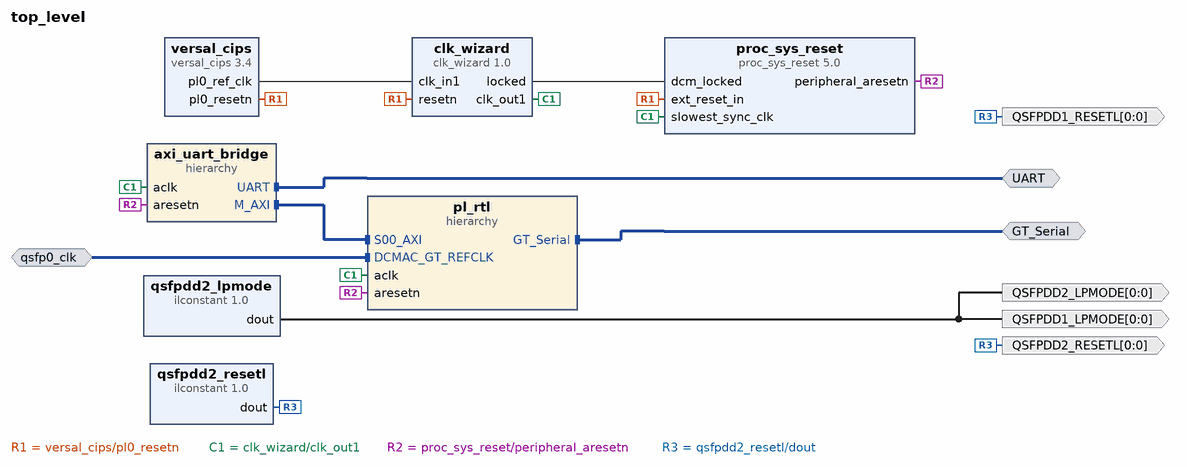
[diagram p0: block diagram of the top level]
# Vivado block design top_level, xcvp1202-vsva2785-2MP-e-S, Vivado 2024.2
create_bd_design top_level

create_bd_intf_port -mode Master -vlnv xilinx.com:interface:uart_rtl:1.0 UART
create_bd_intf_port -mode Master -vlnv xilinx.com:interface:gt_rtl:1.0 GT_Serial
create_bd_intf_port -mode Slave -vlnv xilinx.com:interface:diff_clock_rtl:1.0 qsfp0_clk
set_property -dict {CONFIG.FREQ_HZ 156250000} [get_bd_intf_ports qsfp0_clk]
create_bd_port -dir O -from 0 -to 0 QSFPDD2_LPMODE
create_bd_port -dir O -from 0 -to 0 QSFPDD2_RESETL
create_bd_port -dir O -from 0 -to 0 QSFPDD1_RESETL
create_bd_port -dir O -from 0 -to 0 QSFPDD1_LPMODE

create_bd_cell -type hier pl_rtl
create_bd_cell -type ip -vlnv xilinx.com:ip:clk_wizard:1.0 clk_wizard
set_property -dict [list \
  CONFIG.CLKOUT_DRIVES BUFG,BUFG,BUFG,BUFG,BUFG,BUFG,BUFG \
  CONFIG.CLKOUT_DYN_PS None,None,None,None,None,None,None \
  CONFIG.CLKOUT_MATCHED_ROUTING false,false,false,false,false,false,false \
  CONFIG.CLKOUT_PORT clk_out1,clk_out2,clk_out3,clk_out4,clk_out5,clk_out6,clk_out7 \
  CONFIG.CLKOUT_REQUESTED_DUTY_CYCLE 50.000,50.000,50.000,50.000,50.000,50.000,50.000 \
  CONFIG.CLKOUT_REQUESTED_OUT_FREQUENCY 200,150.000,300.000,100.000,100.000,100.000,100.000 \
  CONFIG.CLKOUT_REQUESTED_PHASE 0.000,0.000,0.000,0.000,0.000,0.000,0.000 \
  CONFIG.CLKOUT_USED true,false,false,false,false,false,false \
  CONFIG.JITTER_SEL Min_O_Jitter \
  CONFIG.PRIM_SOURCE No_buffer \
  CONFIG.RESET_TYPE ACTIVE_LOW \
  CONFIG.USE_LOCKED true \
  CONFIG.USE_PHASE_ALIGNMENT true \
  CONFIG.USE_RESET true \
] [get_bd_cells clk_wizard]
create_bd_cell -type ip -vlnv xilinx.com:ip:proc_sys_reset:5.0 proc_sys_reset
create_bd_cell -type inline_hdl -vlnv xilinx.com:inline_hdl:ilconstant:1.0 qsfpdd2_lpmode
set_property -dict {CONFIG.CONST_VAL 0} [get_bd_cells qsfpdd2_lpmode]
create_bd_cell -type inline_hdl -vlnv xilinx.com:inline_hdl:ilconstant:1.0 qsfpdd2_resetl
create_bd_cell -type ip -vlnv xilinx.com:ip:versal_cips:3.4 versal_cips
set_property -dict [list \
  CONFIG.DDR_MEMORY_MODE Custom \
  CONFIG.DEBUG_MODE JTAG \
  CONFIG.DESIGN_MODE 0 \
  CONFIG.PS_BOARD_INTERFACE Custom \
  CONFIG.PS_PMC_CONFIG {['DEBUG_MODE JTAG DESIGN_MODE 0 PS_BOARD_INTERFACE Custom PS_HSDP_EGRESS_TRAFFIC JTAG PS_HSDP_INGRESS_TRAFFIC JTAG PS_HSDP_MODE NONE PS_NUM_FABRIC_RESETS 1 PS_USE_PMCPL_CLK0 1 SMON_ALARMS Set_Alarms_On', 'SMON_ENABLE_TEMP_AVERAGING 0 SMON_TEMP_AVERAGING_SAMPLES 0']} \
] [get_bd_cells versal_cips]
create_bd_cell -type hier axi_uart_bridge

# ---- hierarchy /pl_rtl ----
current_bd_instance /pl_rtl
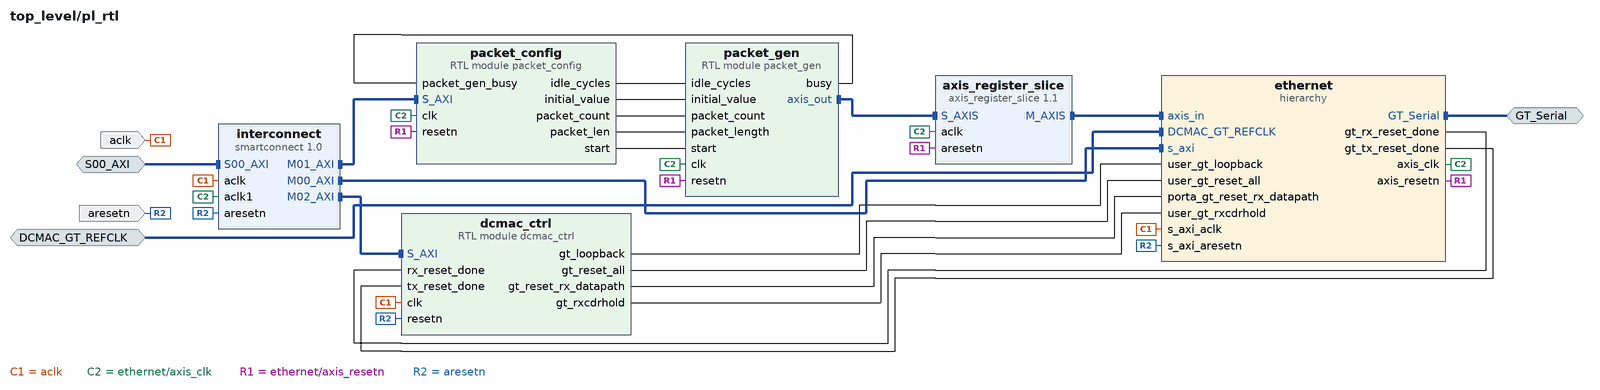
[diagram p1: block diagram inside /pl_rtl]
create_bd_intf_pin -mode Slave -vlnv xilinx.com:interface:diff_clock_rtl:1.0 DCMAC_GT_REFCLK
create_bd_intf_pin -mode Master -vlnv xilinx.com:interface:gt_rtl:1.0 GT_Serial
create_bd_intf_pin -mode Slave -vlnv xilinx.com:interface:aximm_rtl:1.0 S00_AXI
create_bd_pin -dir I -type clk aclk
create_bd_pin -dir I -type rst aresetn

create_bd_cell -type ip -vlnv xilinx.com:ip:smartconnect:1.0 interconnect
set_property -dict {CONFIG.NUM_CLKS 2 CONFIG.NUM_MI 3 CONFIG.NUM_SI 1} [get_bd_cells interconnect]
create_bd_cell -type hier ethernet
create_bd_cell -type module -reference packet_config packet_config
create_bd_cell -type module -reference packet_gen packet_gen
create_bd_cell -type module -reference dcmac_ctrl dcmac_ctrl
create_bd_cell -type ip -vlnv xilinx.com:ip:axis_register_slice:1.1 axis_register_slice

# ---- hierarchy /pl_rtl/ethernet ----
current_bd_instance /pl_rtl/ethernet
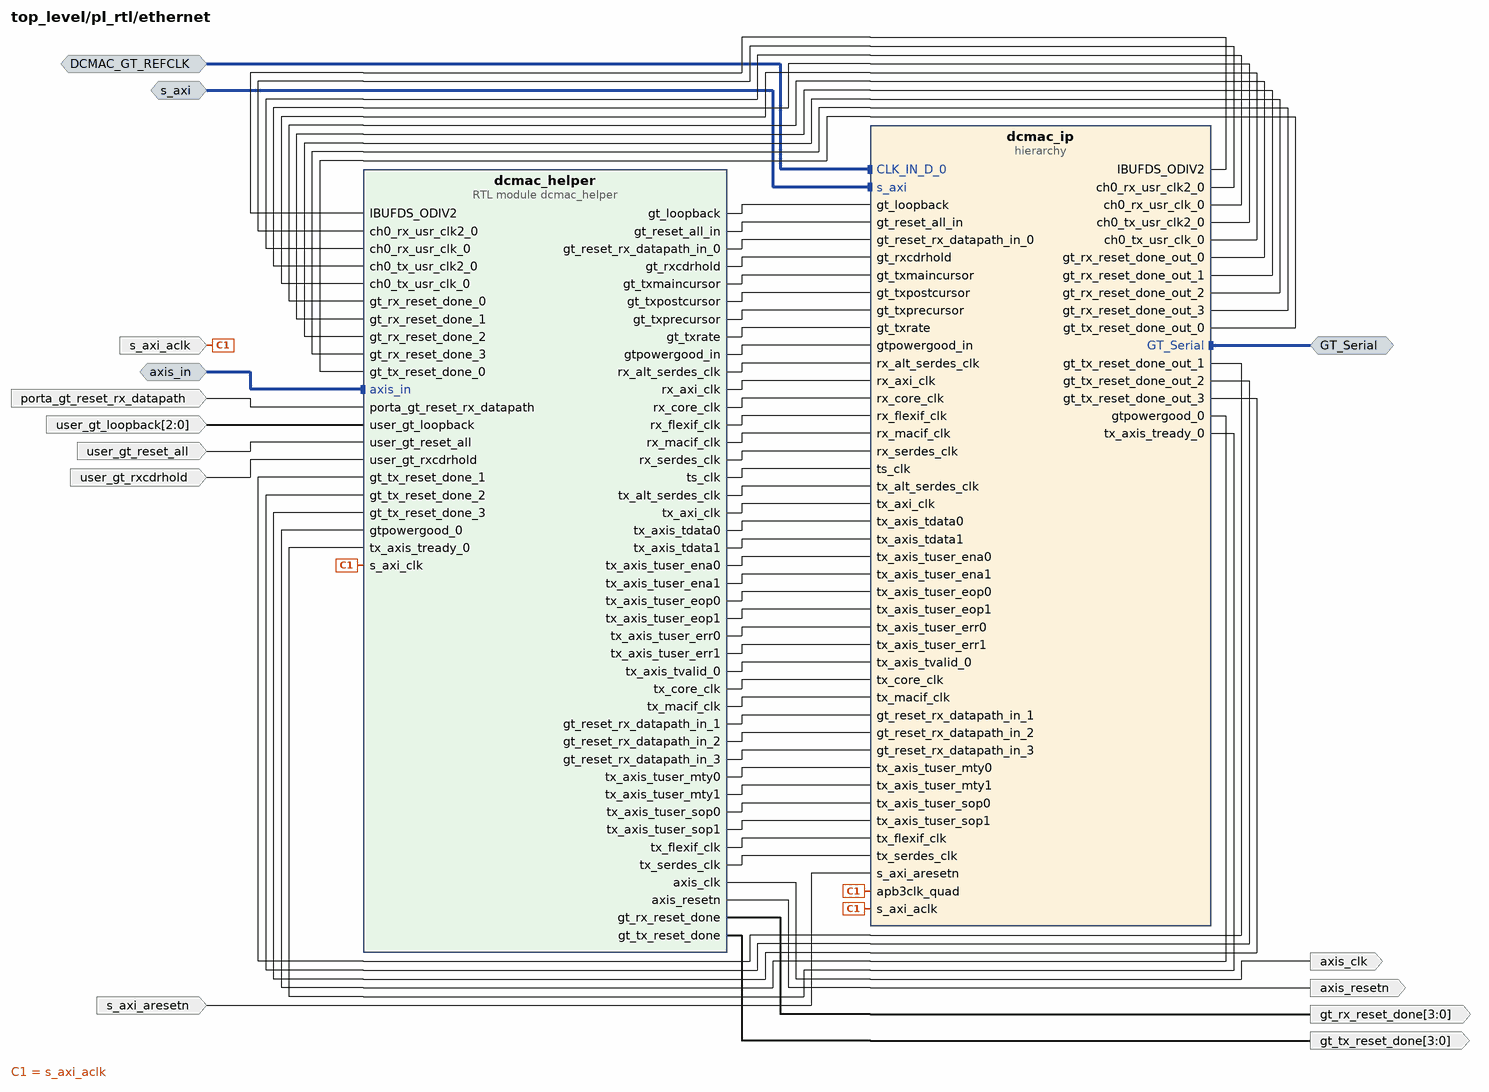
[diagram p2: block diagram inside /pl_rtl/ethernet]
create_bd_intf_pin -mode Slave -vlnv xilinx.com:interface:aximm_rtl:1.0 s_axi
create_bd_intf_pin -mode Master -vlnv xilinx.com:interface:gt_rtl:1.0 GT_Serial
create_bd_intf_pin -mode Slave -vlnv xilinx.com:interface:diff_clock_rtl:1.0 DCMAC_GT_REFCLK
create_bd_intf_pin -mode Slave -vlnv xilinx.com:interface:axis_rtl:1.0 axis_in
create_bd_pin -dir I -type clk s_axi_aclk
create_bd_pin -dir I -type rst s_axi_aresetn
create_bd_pin -dir O axis_clk
create_bd_pin -dir I user_gt_reset_all
create_bd_pin -dir O axis_resetn
create_bd_pin -dir O -from 3 -to 0 gt_rx_reset_done
create_bd_pin -dir O -from 3 -to 0 gt_tx_reset_done
create_bd_pin -dir I porta_gt_reset_rx_datapath
create_bd_pin -dir I -from 2 -to 0 user_gt_loopback
create_bd_pin -dir I user_gt_rxcdrhold

create_bd_cell -type hier dcmac_ip
create_bd_cell -type module -reference dcmac_helper dcmac_helper

# ---- hierarchy /pl_rtl/ethernet/dcmac_ip ----
current_bd_instance /pl_rtl/ethernet/dcmac_ip
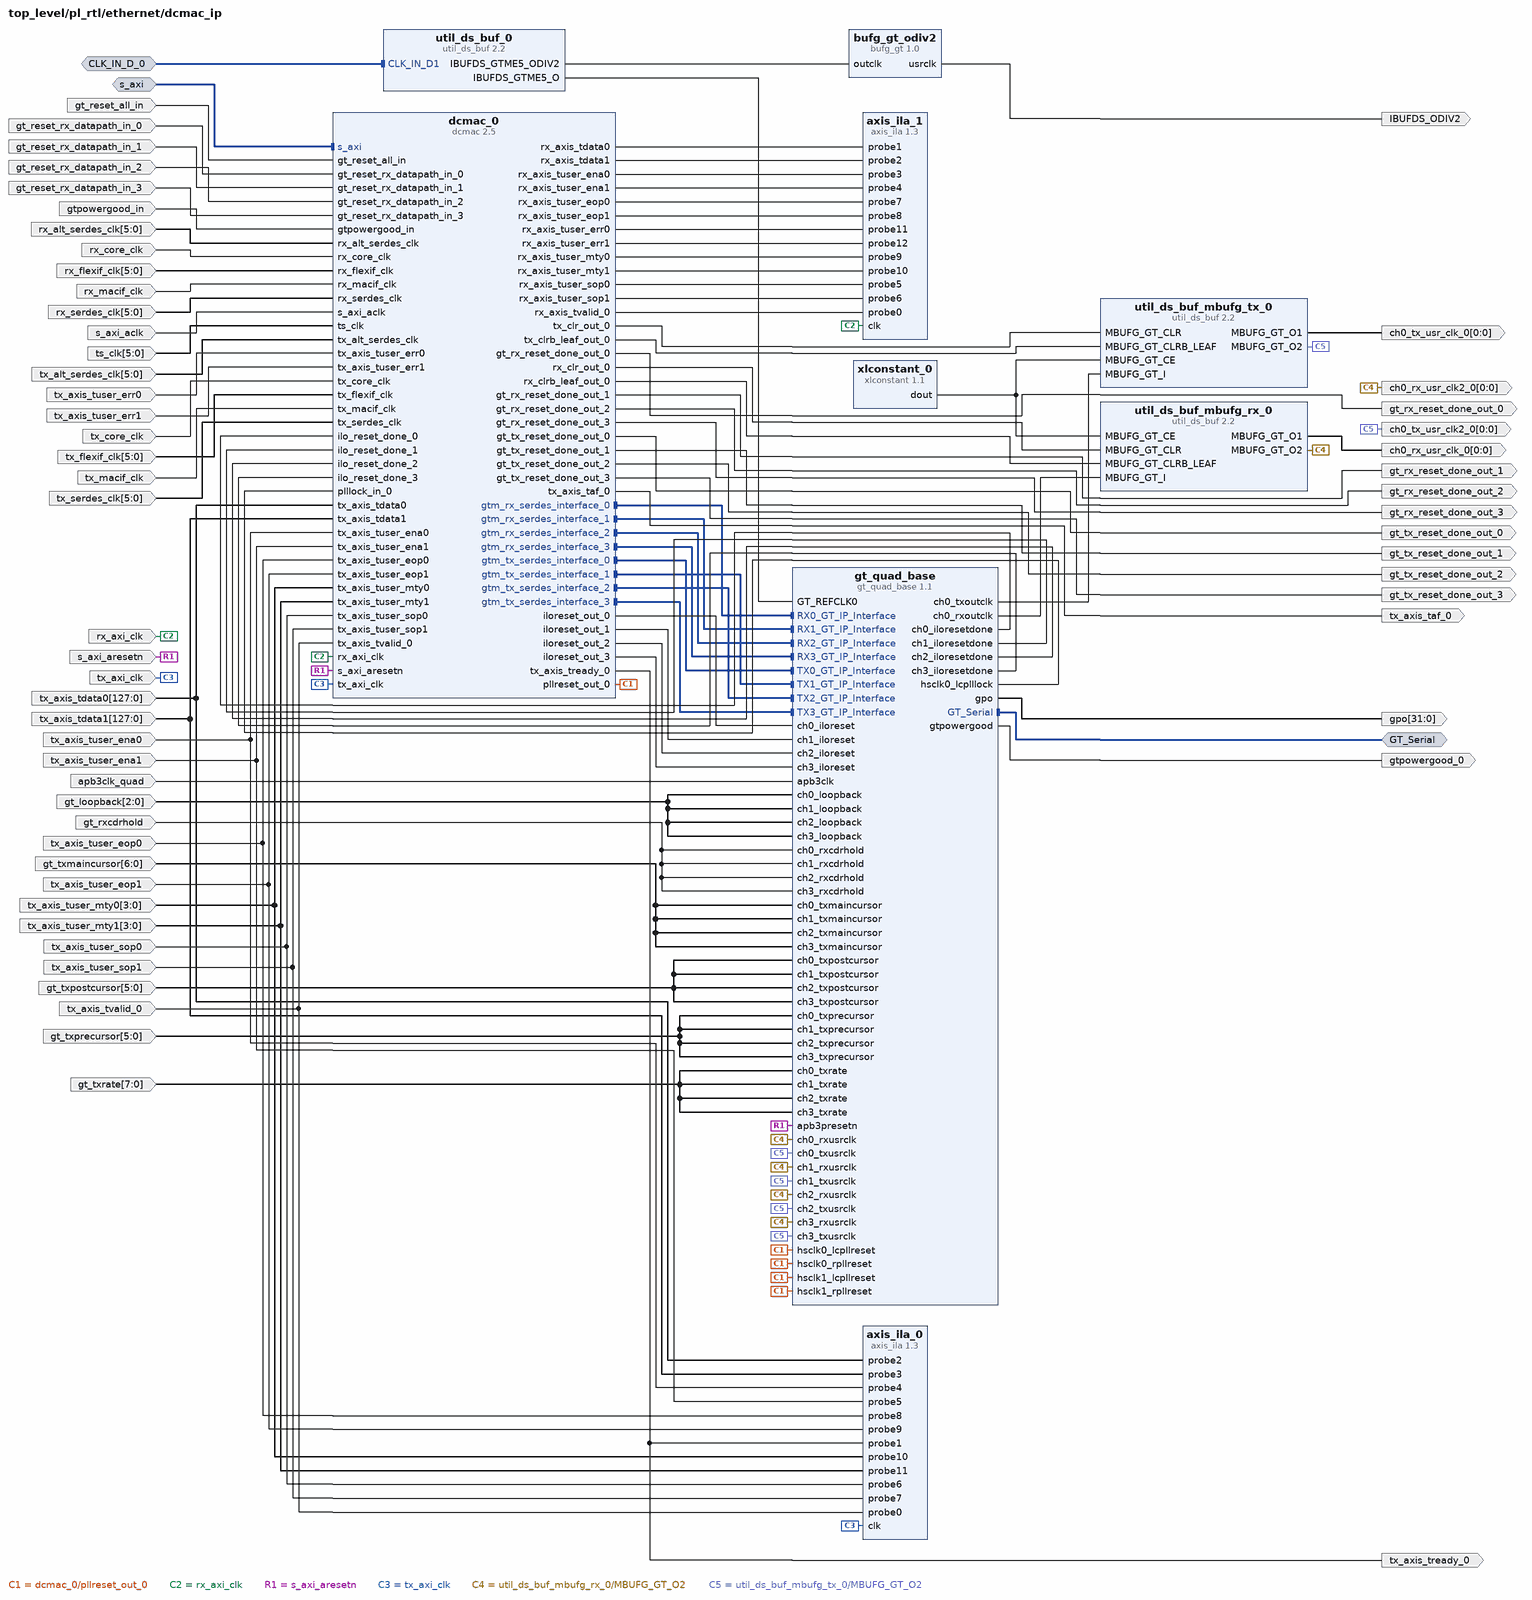
[diagram p3: block diagram inside /pl_rtl/ethernet/dcmac_ip]
create_bd_intf_pin -mode Slave -vlnv xilinx.com:interface:aximm_rtl:1.0 s_axi
create_bd_intf_pin -mode Master -vlnv xilinx.com:interface:gt_rtl:1.0 GT_Serial
create_bd_intf_pin -mode Slave -vlnv xilinx.com:interface:diff_clock_rtl:1.0 CLK_IN_D_0
create_bd_pin -dir I -type clk s_axi_aclk
create_bd_pin -dir I -type rst s_axi_aresetn
create_bd_pin -dir O tx_axis_taf_0
create_bd_pin -dir O tx_axis_tready_0
create_bd_pin -dir I -from 5 -to 0 -type gt_usrclk rx_alt_serdes_clk
create_bd_pin -dir I -type clk rx_axi_clk
create_bd_pin -dir I -type clk rx_core_clk
create_bd_pin -dir I -from 5 -to 0 -type clk rx_flexif_clk
create_bd_pin -dir I -type clk rx_macif_clk
create_bd_pin -dir I -from 5 -to 0 -type gt_usrclk rx_serdes_clk
create_bd_pin -dir I -from 5 -to 0 -type clk ts_clk
create_bd_pin -dir I -from 5 -to 0 -type gt_usrclk tx_alt_serdes_clk
create_bd_pin -dir I -from 127 -to 0 tx_axis_tdata0
create_bd_pin -dir I -from 127 -to 0 tx_axis_tdata1
create_bd_pin -dir I tx_axis_tuser_ena0
create_bd_pin -dir I tx_axis_tuser_ena1
create_bd_pin -dir I tx_axis_tuser_eop0
create_bd_pin -dir I tx_axis_tuser_eop1
create_bd_pin -dir I tx_axis_tuser_err0
create_bd_pin -dir I tx_axis_tuser_err1
create_bd_pin -dir I -from 3 -to 0 tx_axis_tuser_mty0
create_bd_pin -dir I -from 3 -to 0 tx_axis_tuser_mty1
create_bd_pin -dir I tx_axis_tuser_sop0
create_bd_pin -dir I tx_axis_tuser_sop1
create_bd_pin -dir I tx_axis_tvalid_0
create_bd_pin -dir I -type clk tx_axi_clk
create_bd_pin -dir I -type clk tx_core_clk
create_bd_pin -dir I -from 5 -to 0 -type clk tx_flexif_clk
create_bd_pin -dir I -type clk tx_macif_clk
create_bd_pin -dir I -from 5 -to 0 -type gt_usrclk tx_serdes_clk
create_bd_pin -dir O gt_tx_reset_done_out_0
create_bd_pin -dir O gt_rx_reset_done_out_0
create_bd_pin -dir I gtpowergood_in
create_bd_pin -dir I gt_reset_all_in
create_bd_pin -dir I gt_reset_rx_datapath_in_0
create_bd_pin -dir O gt_tx_reset_done_out_1
create_bd_pin -dir O gt_rx_reset_done_out_1
create_bd_pin -dir I gt_reset_rx_datapath_in_1
create_bd_pin -dir O gt_tx_reset_done_out_2
create_bd_pin -dir O gt_rx_reset_done_out_2
create_bd_pin -dir I gt_reset_rx_datapath_in_2
create_bd_pin -dir O gt_tx_reset_done_out_3
create_bd_pin -dir O gt_rx_reset_done_out_3
create_bd_pin -dir I gt_reset_rx_datapath_in_3
create_bd_pin -dir O -type gt_usrclk IBUFDS_ODIV2
create_bd_pin -dir O -from 0 -to 0 -type gt_usrclk ch0_tx_usr_clk_0
create_bd_pin -dir O -from 0 -to 0 -type gt_usrclk ch0_tx_usr_clk2_0
create_bd_pin -dir O -from 0 -to 0 -type gt_usrclk ch0_rx_usr_clk_0
create_bd_pin -dir O -from 0 -to 0 -type gt_usrclk ch0_rx_usr_clk2_0
create_bd_pin -dir O gtpowergood_0
create_bd_pin -dir O -from 31 -to 0 gpo
create_bd_pin -dir I -type clk apb3clk_quad
create_bd_pin -dir I -from 6 -to 0 gt_txmaincursor
create_bd_pin -dir I -from 5 -to 0 gt_txpostcursor
create_bd_pin -dir I -from 5 -to 0 gt_txprecursor
create_bd_pin -dir I -from 7 -to 0 gt_txrate
create_bd_pin -dir I -from 2 -to 0 gt_loopback
create_bd_pin -dir I gt_rxcdrhold

create_bd_cell -type ip -vlnv xilinx.com:ip:dcmac:2.5 dcmac_0
set_property -dict [list \
  CONFIG.MAC_PORT0_CONFIG_C0 100CAUI-4 \
  CONFIG.MAC_PORT0_RX_STRIP_C0 1 \
  CONFIG.MAC_PORT1_ENABLE_C0 0 \
  CONFIG.MAC_PORT2_ENABLE_C0 0 \
  CONFIG.MAC_PORT3_ENABLE_C0 0 \
  CONFIG.MAC_PORT4_ENABLE_C0 0 \
  CONFIG.MAC_PORT5_ENABLE_C0 0 \
] [get_bd_cells dcmac_0]
create_bd_cell -type ip -vlnv xilinx.com:ip:xlconstant:1.1 xlconstant_0
set_property -dict {CONFIG.CONST_VAL 1 CONFIG.CONST_WIDTH 1} [get_bd_cells xlconstant_0]
create_bd_cell -type ip -vlnv xilinx.com:ip:bufg_gt:1.0 bufg_gt_odiv2
create_bd_cell -type ip -vlnv xilinx.com:ip:util_ds_buf:2.2 util_ds_buf_mbufg_tx_0
set_property -dict {CONFIG.C_BUFG_GT_SYNC true CONFIG.C_BUF_TYPE MBUFG_GT} [get_bd_cells util_ds_buf_mbufg_tx_0]
create_bd_cell -type ip -vlnv xilinx.com:ip:util_ds_buf:2.2 util_ds_buf_mbufg_rx_0
set_property -dict {CONFIG.C_BUFG_GT_SYNC true CONFIG.C_BUF_TYPE MBUFG_GT} [get_bd_cells util_ds_buf_mbufg_rx_0]
create_bd_cell -type ip -vlnv xilinx.com:ip:gt_quad_base:1.1 gt_quad_base
set_property -dict [list \
  CONFIG.APB3_CLK_FREQUENCY 199.999995 \
  CONFIG.PORTS_INFO_DICT {LANE_SEL_DICT {PROT0 {RX0 RX1 RX2 RX3 TX0 TX1 TX2 TX3}} GT_TYPE GTM REG_CONF_INTF APB3_INTF BOARD_PARAMETER { }} \
  CONFIG.REFCLK_LIST {{/qsfp0_clk_clk_p[0]}} \
  CONFIG.REFCLK_STRING {HSCLK0_LCPLLGTREFCLK0 refclk_PROT0_R0_156.25_MHz_unique1} \
] [get_bd_cells gt_quad_base]
create_bd_cell -type ip -vlnv xilinx.com:ip:util_ds_buf:2.2 util_ds_buf_0
set_property -dict {CONFIG.C_BUF_TYPE IBUFDS_GTME5} [get_bd_cells util_ds_buf_0]
create_bd_cell -type ip -vlnv xilinx.com:ip:axis_ila:1.3 axis_ila_0
set_property -dict [list \
  CONFIG.C_NUM_OF_PROBES 12 \
  CONFIG.C_PROBE10_WIDTH 4 \
  CONFIG.C_PROBE11_WIDTH 4 \
  CONFIG.C_PROBE2_WIDTH 128 \
  CONFIG.C_PROBE3_WIDTH 128 \
] [get_bd_cells axis_ila_0]
create_bd_cell -type ip -vlnv xilinx.com:ip:axis_ila:1.3 axis_ila_1
set_property -dict [list \
  CONFIG.C_NUM_OF_PROBES 13 \
  CONFIG.C_PROBE10_WIDTH 4 \
  CONFIG.C_PROBE1_WIDTH 128 \
  CONFIG.C_PROBE2_WIDTH 128 \
  CONFIG.C_PROBE9_WIDTH 4 \
  CONFIG.C_PROBE_WIDTH_PROPAGATION MANUAL \
] [get_bd_cells axis_ila_1]

# ---- hierarchy /axi_uart_bridge ----
current_bd_instance /axi_uart_bridge
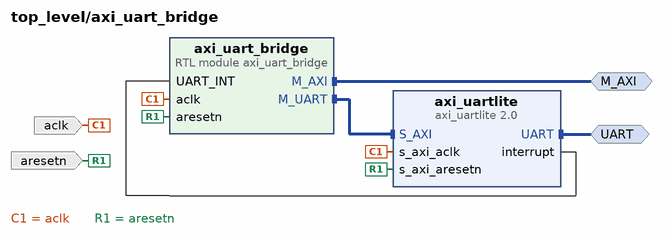
[diagram p4: block diagram inside /axi_uart_bridge]
create_bd_intf_pin -mode Master -vlnv xilinx.com:interface:uart_rtl:1.0 UART
create_bd_intf_pin -mode Master -vlnv xilinx.com:interface:aximm_rtl:1.0 M_AXI
create_bd_pin -dir I aclk
create_bd_pin -dir I aresetn

create_bd_cell -type module -reference axi_uart_bridge axi_uart_bridge
create_bd_cell -type ip -vlnv xilinx.com:ip:axi_uartlite:2.0 axi_uartlite
set_property -dict {CONFIG.C_BAUDRATE 115200} [get_bd_cells axi_uartlite]

# ---- connections ----

current_bd_instance /pl_rtl
connect_bd_intf_net [get_bd_intf_pins ethernet/DCMAC_GT_REFCLK] [get_bd_intf_pins DCMAC_GT_REFCLK]
connect_bd_intf_net [get_bd_intf_pins ethernet/GT_Serial] [get_bd_intf_pins GT_Serial]
connect_bd_intf_net [get_bd_intf_pins interconnect/S00_AXI] [get_bd_intf_pins S00_AXI]
connect_bd_intf_net -intf_net axis_register_slice_0_M_AXIS [get_bd_intf_pins axis_register_slice/M_AXIS] [get_bd_intf_pins ethernet/axis_in]
connect_bd_intf_net -intf_net icn_ctrl_M01_AXI [get_bd_intf_pins packet_config/S_AXI] [get_bd_intf_pins interconnect/M01_AXI]
connect_bd_intf_net -intf_net icn_ctrl_M02_AXI [get_bd_intf_pins interconnect/M02_AXI] [get_bd_intf_pins dcmac_ctrl/S_AXI]
connect_bd_intf_net [get_bd_intf_pins axis_register_slice/S_AXIS] [get_bd_intf_pins packet_gen/axis_out]
connect_bd_intf_net [get_bd_intf_pins ethernet/s_axi] [get_bd_intf_pins interconnect/M00_AXI]
connect_bd_net -net clk_wizard_0_clk_out1 [get_bd_pins aclk] \
  [get_bd_pins interconnect/aclk] [get_bd_pins ethernet/s_axi_aclk] [get_bd_pins dcmac_ctrl/clk]
connect_bd_net -net dcmac_ctrl_0_gt_loopback [get_bd_pins dcmac_ctrl/gt_loopback] [get_bd_pins ethernet/user_gt_loopback]
connect_bd_net -net dcmac_ctrl_0_gt_reset_all [get_bd_pins dcmac_ctrl/gt_reset_all] [get_bd_pins ethernet/user_gt_reset_all]
connect_bd_net -net dcmac_ctrl_0_gt_reset_rx_datapath [get_bd_pins dcmac_ctrl/gt_reset_rx_datapath] [get_bd_pins ethernet/porta_gt_reset_rx_datapath]
connect_bd_net -net dcmac_ctrl_0_gt_rxcdrhold [get_bd_pins dcmac_ctrl/gt_rxcdrhold] [get_bd_pins ethernet/user_gt_rxcdrhold]
connect_bd_net [get_bd_pins ethernet/axis_clk] \
  [get_bd_pins packet_config/clk] [get_bd_pins packet_gen/clk] [get_bd_pins interconnect/aclk1] \
  [get_bd_pins axis_register_slice/aclk]
connect_bd_net [get_bd_pins ethernet/axis_resetn] \
  [get_bd_pins packet_config/resetn] [get_bd_pins packet_gen/resetn] [get_bd_pins axis_register_slice/aresetn]
connect_bd_net [get_bd_pins ethernet/gt_rx_reset_done] [get_bd_pins dcmac_ctrl/rx_reset_done]
connect_bd_net [get_bd_pins ethernet/gt_tx_reset_done] [get_bd_pins dcmac_ctrl/tx_reset_done]
connect_bd_net [get_bd_pins packet_config/idle_cycles] [get_bd_pins packet_gen/idle_cycles]
connect_bd_net [get_bd_pins packet_config/initial_value] [get_bd_pins packet_gen/initial_value]
connect_bd_net [get_bd_pins packet_config/packet_count] [get_bd_pins packet_gen/packet_count]
connect_bd_net [get_bd_pins packet_config/packet_len] [get_bd_pins packet_gen/packet_length]
connect_bd_net [get_bd_pins packet_config/start] [get_bd_pins packet_gen/start]
connect_bd_net [get_bd_pins packet_gen/busy] [get_bd_pins packet_config/packet_gen_busy]
connect_bd_net -net proc_sys_reset_0_peripheral_aresetn [get_bd_pins aresetn] \
  [get_bd_pins interconnect/aresetn] [get_bd_pins ethernet/s_axi_aresetn] [get_bd_pins dcmac_ctrl/resetn]

current_bd_instance /pl_rtl/ethernet
connect_bd_intf_net -intf_net CLK_IN_D_0_1 [get_bd_intf_pins DCMAC_GT_REFCLK] [get_bd_intf_pins dcmac_ip/CLK_IN_D_0]
connect_bd_intf_net [get_bd_intf_pins axis_in] [get_bd_intf_pins dcmac_helper/axis_in]
connect_bd_intf_net -intf_net gt_quad_base_GT_Serial [get_bd_intf_pins GT_Serial] [get_bd_intf_pins dcmac_ip/GT_Serial]
connect_bd_intf_net [get_bd_intf_pins s_axi] [get_bd_intf_pins dcmac_ip/s_axi]
connect_bd_net [get_bd_pins dcmac_helper/axis_clk] [get_bd_pins axis_clk]
connect_bd_net [get_bd_pins dcmac_helper/axis_resetn] [get_bd_pins axis_resetn]
connect_bd_net [get_bd_pins dcmac_helper/gt_loopback] [get_bd_pins dcmac_ip/gt_loopback]
connect_bd_net [get_bd_pins dcmac_helper/gt_reset_all_in] [get_bd_pins dcmac_ip/gt_reset_all_in]
connect_bd_net [get_bd_pins dcmac_helper/gt_reset_rx_datapath_in_0] [get_bd_pins dcmac_ip/gt_reset_rx_datapath_in_0]
connect_bd_net [get_bd_pins dcmac_helper/gt_rx_reset_done] [get_bd_pins gt_rx_reset_done]
connect_bd_net [get_bd_pins dcmac_helper/gt_rxcdrhold] [get_bd_pins dcmac_ip/gt_rxcdrhold]
connect_bd_net [get_bd_pins dcmac_helper/gt_tx_reset_done] [get_bd_pins gt_tx_reset_done]
connect_bd_net [get_bd_pins dcmac_helper/gt_txmaincursor] [get_bd_pins dcmac_ip/gt_txmaincursor]
connect_bd_net [get_bd_pins dcmac_helper/gt_txpostcursor] [get_bd_pins dcmac_ip/gt_txpostcursor]
connect_bd_net [get_bd_pins dcmac_helper/gt_txprecursor] [get_bd_pins dcmac_ip/gt_txprecursor]
connect_bd_net [get_bd_pins dcmac_helper/gt_txrate] [get_bd_pins dcmac_ip/gt_txrate]
connect_bd_net [get_bd_pins dcmac_helper/gtpowergood_in] [get_bd_pins dcmac_ip/gtpowergood_in]
connect_bd_net [get_bd_pins dcmac_helper/rx_alt_serdes_clk] [get_bd_pins dcmac_ip/rx_alt_serdes_clk]
connect_bd_net [get_bd_pins dcmac_helper/rx_axi_clk] [get_bd_pins dcmac_ip/rx_axi_clk]
connect_bd_net [get_bd_pins dcmac_helper/rx_core_clk] [get_bd_pins dcmac_ip/rx_core_clk]
connect_bd_net [get_bd_pins dcmac_helper/rx_flexif_clk] [get_bd_pins dcmac_ip/rx_flexif_clk]
connect_bd_net [get_bd_pins dcmac_helper/rx_macif_clk] [get_bd_pins dcmac_ip/rx_macif_clk]
connect_bd_net [get_bd_pins dcmac_helper/rx_serdes_clk] [get_bd_pins dcmac_ip/rx_serdes_clk]
connect_bd_net [get_bd_pins dcmac_helper/ts_clk] [get_bd_pins dcmac_ip/ts_clk]
connect_bd_net [get_bd_pins dcmac_helper/tx_alt_serdes_clk] [get_bd_pins dcmac_ip/tx_alt_serdes_clk]
connect_bd_net [get_bd_pins dcmac_helper/tx_axi_clk] [get_bd_pins dcmac_ip/tx_axi_clk]
connect_bd_net [get_bd_pins dcmac_helper/tx_axis_tdata0] [get_bd_pins dcmac_ip/tx_axis_tdata0]
connect_bd_net [get_bd_pins dcmac_helper/tx_axis_tdata1] [get_bd_pins dcmac_ip/tx_axis_tdata1]
connect_bd_net [get_bd_pins dcmac_helper/tx_axis_tuser_ena0] [get_bd_pins dcmac_ip/tx_axis_tuser_ena0]
connect_bd_net [get_bd_pins dcmac_helper/tx_axis_tuser_ena1] [get_bd_pins dcmac_ip/tx_axis_tuser_ena1]
connect_bd_net [get_bd_pins dcmac_helper/tx_axis_tuser_eop0] [get_bd_pins dcmac_ip/tx_axis_tuser_eop0]
connect_bd_net [get_bd_pins dcmac_helper/tx_axis_tuser_eop1] [get_bd_pins dcmac_ip/tx_axis_tuser_eop1]
connect_bd_net [get_bd_pins dcmac_helper/tx_axis_tuser_err0] [get_bd_pins dcmac_ip/tx_axis_tuser_err0]
connect_bd_net [get_bd_pins dcmac_helper/tx_axis_tuser_err1] [get_bd_pins dcmac_ip/tx_axis_tuser_err1]
connect_bd_net [get_bd_pins dcmac_helper/tx_axis_tvalid_0] [get_bd_pins dcmac_ip/tx_axis_tvalid_0]
connect_bd_net [get_bd_pins dcmac_helper/tx_core_clk] [get_bd_pins dcmac_ip/tx_core_clk]
connect_bd_net [get_bd_pins dcmac_helper/tx_macif_clk] [get_bd_pins dcmac_ip/tx_macif_clk]
connect_bd_net [get_bd_pins dcmac_ip/IBUFDS_ODIV2] [get_bd_pins dcmac_helper/IBUFDS_ODIV2]
connect_bd_net [get_bd_pins dcmac_ip/ch0_rx_usr_clk2_0] [get_bd_pins dcmac_helper/ch0_rx_usr_clk2_0]
connect_bd_net [get_bd_pins dcmac_ip/ch0_rx_usr_clk_0] [get_bd_pins dcmac_helper/ch0_rx_usr_clk_0]
connect_bd_net [get_bd_pins dcmac_ip/ch0_tx_usr_clk2_0] [get_bd_pins dcmac_helper/ch0_tx_usr_clk2_0]
connect_bd_net [get_bd_pins dcmac_ip/ch0_tx_usr_clk_0] [get_bd_pins dcmac_helper/ch0_tx_usr_clk_0]
connect_bd_net [get_bd_pins dcmac_ip/gt_rx_reset_done_out_0] [get_bd_pins dcmac_helper/gt_rx_reset_done_0]
connect_bd_net [get_bd_pins dcmac_ip/gt_rx_reset_done_out_1] [get_bd_pins dcmac_helper/gt_rx_reset_done_1]
connect_bd_net [get_bd_pins dcmac_ip/gt_rx_reset_done_out_2] [get_bd_pins dcmac_helper/gt_rx_reset_done_2]
connect_bd_net [get_bd_pins dcmac_ip/gt_rx_reset_done_out_3] [get_bd_pins dcmac_helper/gt_rx_reset_done_3]
connect_bd_net [get_bd_pins dcmac_ip/gt_tx_reset_done_out_0] [get_bd_pins dcmac_helper/gt_tx_reset_done_0]
connect_bd_net [get_bd_pins dcmac_ip/gt_tx_reset_done_out_1] [get_bd_pins dcmac_helper/gt_tx_reset_done_1]
connect_bd_net [get_bd_pins dcmac_ip/gt_tx_reset_done_out_2] [get_bd_pins dcmac_helper/gt_tx_reset_done_2]
connect_bd_net [get_bd_pins dcmac_ip/gt_tx_reset_done_out_3] [get_bd_pins dcmac_helper/gt_tx_reset_done_3]
connect_bd_net [get_bd_pins dcmac_ip/gtpowergood_0] [get_bd_pins dcmac_helper/gtpowergood_0]
connect_bd_net [get_bd_pins dcmac_ip/tx_axis_tready_0] [get_bd_pins dcmac_helper/tx_axis_tready_0]
connect_bd_net -net gt_reset_rx_datapath_in_1_1 [get_bd_pins dcmac_helper/gt_reset_rx_datapath_in_1] [get_bd_pins dcmac_ip/gt_reset_rx_datapath_in_1]
connect_bd_net -net gt_reset_rx_datapath_in_2_1 [get_bd_pins dcmac_helper/gt_reset_rx_datapath_in_2] [get_bd_pins dcmac_ip/gt_reset_rx_datapath_in_2]
connect_bd_net -net gt_reset_rx_datapath_in_3_1 [get_bd_pins dcmac_helper/gt_reset_rx_datapath_in_3] [get_bd_pins dcmac_ip/gt_reset_rx_datapath_in_3]
connect_bd_net [get_bd_pins porta_gt_reset_rx_datapath] [get_bd_pins dcmac_helper/porta_gt_reset_rx_datapath]
connect_bd_net [get_bd_pins s_axi_aclk] [get_bd_pins dcmac_ip/s_axi_aclk] [get_bd_pins dcmac_ip/apb3clk_quad] [get_bd_pins dcmac_helper/s_axi_clk]
connect_bd_net [get_bd_pins s_axi_aresetn] [get_bd_pins dcmac_ip/s_axi_aresetn]
connect_bd_net -net tx_axis_tuser_mty0_1 [get_bd_pins dcmac_helper/tx_axis_tuser_mty0] [get_bd_pins dcmac_ip/tx_axis_tuser_mty0]
connect_bd_net -net tx_axis_tuser_mty1_1 [get_bd_pins dcmac_helper/tx_axis_tuser_mty1] [get_bd_pins dcmac_ip/tx_axis_tuser_mty1]
connect_bd_net -net tx_axis_tuser_sop0_1 [get_bd_pins dcmac_helper/tx_axis_tuser_sop0] [get_bd_pins dcmac_ip/tx_axis_tuser_sop0]
connect_bd_net -net tx_axis_tuser_sop1_1 [get_bd_pins dcmac_helper/tx_axis_tuser_sop1] [get_bd_pins dcmac_ip/tx_axis_tuser_sop1]
connect_bd_net -net tx_macif_clk_1 [get_bd_pins dcmac_helper/tx_flexif_clk] [get_bd_pins dcmac_ip/tx_flexif_clk]
connect_bd_net -net tx_serdes_clk_1 [get_bd_pins dcmac_helper/tx_serdes_clk] [get_bd_pins dcmac_ip/tx_serdes_clk]
connect_bd_net [get_bd_pins user_gt_loopback] [get_bd_pins dcmac_helper/user_gt_loopback]
connect_bd_net [get_bd_pins user_gt_reset_all] [get_bd_pins dcmac_helper/user_gt_reset_all]
connect_bd_net [get_bd_pins user_gt_rxcdrhold] [get_bd_pins dcmac_helper/user_gt_rxcdrhold]

current_bd_instance /pl_rtl/ethernet/dcmac_ip
connect_bd_intf_net [get_bd_intf_pins util_ds_buf_0/CLK_IN_D1] [get_bd_intf_pins CLK_IN_D_0]
connect_bd_intf_net [get_bd_intf_pins dcmac_0/gtm_rx_serdes_interface_0] [get_bd_intf_pins gt_quad_base/RX0_GT_IP_Interface]
connect_bd_intf_net [get_bd_intf_pins gt_quad_base/RX1_GT_IP_Interface] [get_bd_intf_pins dcmac_0/gtm_rx_serdes_interface_1]
connect_bd_intf_net [get_bd_intf_pins gt_quad_base/RX2_GT_IP_Interface] [get_bd_intf_pins dcmac_0/gtm_rx_serdes_interface_2]
connect_bd_intf_net [get_bd_intf_pins dcmac_0/gtm_rx_serdes_interface_3] [get_bd_intf_pins gt_quad_base/RX3_GT_IP_Interface]
connect_bd_intf_net [get_bd_intf_pins dcmac_0/gtm_tx_serdes_interface_0] [get_bd_intf_pins gt_quad_base/TX0_GT_IP_Interface]
connect_bd_intf_net [get_bd_intf_pins dcmac_0/gtm_tx_serdes_interface_1] [get_bd_intf_pins gt_quad_base/TX1_GT_IP_Interface]
connect_bd_intf_net [get_bd_intf_pins dcmac_0/gtm_tx_serdes_interface_2] [get_bd_intf_pins gt_quad_base/TX2_GT_IP_Interface]
connect_bd_intf_net [get_bd_intf_pins dcmac_0/gtm_tx_serdes_interface_3] [get_bd_intf_pins gt_quad_base/TX3_GT_IP_Interface]
connect_bd_intf_net [get_bd_intf_pins GT_Serial] [get_bd_intf_pins gt_quad_base/GT_Serial]
connect_bd_intf_net [get_bd_intf_pins s_axi] [get_bd_intf_pins dcmac_0/s_axi]
connect_bd_net [get_bd_pins apb3clk_quad] [get_bd_pins gt_quad_base/apb3clk]
connect_bd_net [get_bd_pins bufg_gt_odiv2/usrclk] [get_bd_pins IBUFDS_ODIV2]
connect_bd_net [get_bd_pins dcmac_0/gt_rx_reset_done_out_0] [get_bd_pins gt_rx_reset_done_out_0]
connect_bd_net [get_bd_pins dcmac_0/gt_rx_reset_done_out_1] [get_bd_pins gt_rx_reset_done_out_1]
connect_bd_net [get_bd_pins dcmac_0/gt_rx_reset_done_out_2] [get_bd_pins gt_rx_reset_done_out_2]
connect_bd_net [get_bd_pins dcmac_0/gt_rx_reset_done_out_3] [get_bd_pins gt_rx_reset_done_out_3]
connect_bd_net [get_bd_pins dcmac_0/gt_tx_reset_done_out_0] [get_bd_pins gt_tx_reset_done_out_0]
connect_bd_net [get_bd_pins dcmac_0/gt_tx_reset_done_out_1] [get_bd_pins gt_tx_reset_done_out_1]
connect_bd_net [get_bd_pins dcmac_0/gt_tx_reset_done_out_2] [get_bd_pins gt_tx_reset_done_out_2]
connect_bd_net [get_bd_pins dcmac_0/gt_tx_reset_done_out_3] [get_bd_pins gt_tx_reset_done_out_3]
connect_bd_net [get_bd_pins dcmac_0/iloreset_out_0] [get_bd_pins gt_quad_base/ch0_iloreset]
connect_bd_net [get_bd_pins dcmac_0/iloreset_out_1] [get_bd_pins gt_quad_base/ch1_iloreset]
connect_bd_net [get_bd_pins dcmac_0/iloreset_out_2] [get_bd_pins gt_quad_base/ch2_iloreset]
connect_bd_net [get_bd_pins dcmac_0/iloreset_out_3] [get_bd_pins gt_quad_base/ch3_iloreset]
connect_bd_net [get_bd_pins dcmac_0/pllreset_out_0] \
  [get_bd_pins gt_quad_base/hsclk0_lcpllreset] [get_bd_pins gt_quad_base/hsclk1_lcpllreset] \
  [get_bd_pins gt_quad_base/hsclk0_rpllreset] [get_bd_pins gt_quad_base/hsclk1_rpllreset]
connect_bd_net [get_bd_pins dcmac_0/rx_axis_tdata0] [get_bd_pins axis_ila_1/probe1]
connect_bd_net [get_bd_pins dcmac_0/rx_axis_tdata1] [get_bd_pins axis_ila_1/probe2]
connect_bd_net [get_bd_pins dcmac_0/rx_axis_tuser_ena0] [get_bd_pins axis_ila_1/probe3]
connect_bd_net [get_bd_pins dcmac_0/rx_axis_tuser_ena1] [get_bd_pins axis_ila_1/probe4]
connect_bd_net [get_bd_pins dcmac_0/rx_axis_tuser_eop0] [get_bd_pins axis_ila_1/probe7]
connect_bd_net [get_bd_pins dcmac_0/rx_axis_tuser_eop1] [get_bd_pins axis_ila_1/probe8]
connect_bd_net [get_bd_pins dcmac_0/rx_axis_tuser_err0] [get_bd_pins axis_ila_1/probe11]
connect_bd_net [get_bd_pins dcmac_0/rx_axis_tuser_err1] [get_bd_pins axis_ila_1/probe12]
connect_bd_net [get_bd_pins dcmac_0/rx_axis_tuser_mty0] [get_bd_pins axis_ila_1/probe9]
connect_bd_net [get_bd_pins dcmac_0/rx_axis_tuser_mty1] [get_bd_pins axis_ila_1/probe10]
connect_bd_net [get_bd_pins dcmac_0/rx_axis_tuser_sop0] [get_bd_pins axis_ila_1/probe5]
connect_bd_net [get_bd_pins dcmac_0/rx_axis_tuser_sop1] [get_bd_pins axis_ila_1/probe6]
connect_bd_net [get_bd_pins dcmac_0/rx_axis_tvalid_0] [get_bd_pins axis_ila_1/probe0]
connect_bd_net [get_bd_pins dcmac_0/rx_clr_out_0] [get_bd_pins util_ds_buf_mbufg_rx_0/MBUFG_GT_CLR]
connect_bd_net [get_bd_pins dcmac_0/rx_clrb_leaf_out_0] [get_bd_pins util_ds_buf_mbufg_rx_0/MBUFG_GT_CLRB_LEAF]
connect_bd_net [get_bd_pins dcmac_0/tx_axis_taf_0] [get_bd_pins tx_axis_taf_0]
connect_bd_net [get_bd_pins dcmac_0/tx_axis_tready_0] [get_bd_pins tx_axis_tready_0] [get_bd_pins axis_ila_0/probe1]
connect_bd_net [get_bd_pins dcmac_0/tx_clr_out_0] [get_bd_pins util_ds_buf_mbufg_tx_0/MBUFG_GT_CLR]
connect_bd_net [get_bd_pins dcmac_0/tx_clrb_leaf_out_0] [get_bd_pins util_ds_buf_mbufg_tx_0/MBUFG_GT_CLRB_LEAF]
connect_bd_net [get_bd_pins gt_loopback] \
  [get_bd_pins gt_quad_base/ch0_loopback] [get_bd_pins gt_quad_base/ch1_loopback] [get_bd_pins gt_quad_base/ch2_loopback] \
  [get_bd_pins gt_quad_base/ch3_loopback]
connect_bd_net [get_bd_pins gt_quad_base/ch0_iloresetdone] [get_bd_pins dcmac_0/ilo_reset_done_0]
connect_bd_net [get_bd_pins gt_quad_base/ch0_rxoutclk] [get_bd_pins util_ds_buf_mbufg_rx_0/MBUFG_GT_I]
connect_bd_net [get_bd_pins gt_quad_base/ch0_txoutclk] [get_bd_pins util_ds_buf_mbufg_tx_0/MBUFG_GT_I]
connect_bd_net [get_bd_pins gt_quad_base/ch1_iloresetdone] [get_bd_pins dcmac_0/ilo_reset_done_1]
connect_bd_net [get_bd_pins gt_quad_base/ch2_iloresetdone] [get_bd_pins dcmac_0/ilo_reset_done_2]
connect_bd_net [get_bd_pins gt_quad_base/ch3_iloresetdone] [get_bd_pins dcmac_0/ilo_reset_done_3]
connect_bd_net [get_bd_pins gt_quad_base/gpo] [get_bd_pins gpo]
connect_bd_net [get_bd_pins gt_quad_base/gtpowergood] [get_bd_pins gtpowergood_0]
connect_bd_net [get_bd_pins gt_quad_base/hsclk0_lcplllock] [get_bd_pins dcmac_0/plllock_in_0]
connect_bd_net [get_bd_pins gt_reset_all_in] [get_bd_pins dcmac_0/gt_reset_all_in]
connect_bd_net -net gt_reset_rx_datapath_in_0_1 [get_bd_pins gt_reset_rx_datapath_in_0] [get_bd_pins dcmac_0/gt_reset_rx_datapath_in_0]
connect_bd_net -net gt_reset_rx_datapath_in_1_1 [get_bd_pins gt_reset_rx_datapath_in_1] [get_bd_pins dcmac_0/gt_reset_rx_datapath_in_1]
connect_bd_net -net gt_reset_rx_datapath_in_2_1 [get_bd_pins gt_reset_rx_datapath_in_2] [get_bd_pins dcmac_0/gt_reset_rx_datapath_in_2]
connect_bd_net -net gt_reset_rx_datapath_in_3_1 [get_bd_pins gt_reset_rx_datapath_in_3] [get_bd_pins dcmac_0/gt_reset_rx_datapath_in_3]
connect_bd_net [get_bd_pins gt_rxcdrhold] \
  [get_bd_pins gt_quad_base/ch0_rxcdrhold] [get_bd_pins gt_quad_base/ch1_rxcdrhold] [get_bd_pins gt_quad_base/ch2_rxcdrhold] \
  [get_bd_pins gt_quad_base/ch3_rxcdrhold]
connect_bd_net [get_bd_pins gt_txmaincursor] \
  [get_bd_pins gt_quad_base/ch0_txmaincursor] [get_bd_pins gt_quad_base/ch1_txmaincursor] \
  [get_bd_pins gt_quad_base/ch2_txmaincursor] [get_bd_pins gt_quad_base/ch3_txmaincursor]
connect_bd_net [get_bd_pins gt_txpostcursor] \
  [get_bd_pins gt_quad_base/ch0_txpostcursor] [get_bd_pins gt_quad_base/ch1_txpostcursor] \
  [get_bd_pins gt_quad_base/ch2_txpostcursor] [get_bd_pins gt_quad_base/ch3_txpostcursor]
connect_bd_net [get_bd_pins gt_txprecursor] \
  [get_bd_pins gt_quad_base/ch0_txprecursor] [get_bd_pins gt_quad_base/ch2_txprecursor] \
  [get_bd_pins gt_quad_base/ch3_txprecursor] [get_bd_pins gt_quad_base/ch1_txprecursor]
connect_bd_net [get_bd_pins gt_txrate] \
  [get_bd_pins gt_quad_base/ch0_txrate] [get_bd_pins gt_quad_base/ch1_txrate] [get_bd_pins gt_quad_base/ch2_txrate] \
  [get_bd_pins gt_quad_base/ch3_txrate]
connect_bd_net [get_bd_pins gtpowergood_in] [get_bd_pins dcmac_0/gtpowergood_in]
connect_bd_net [get_bd_pins rx_alt_serdes_clk] [get_bd_pins dcmac_0/rx_alt_serdes_clk]
connect_bd_net [get_bd_pins rx_axi_clk] [get_bd_pins dcmac_0/rx_axi_clk] [get_bd_pins axis_ila_1/clk]
connect_bd_net [get_bd_pins rx_core_clk] [get_bd_pins dcmac_0/rx_core_clk]
connect_bd_net [get_bd_pins rx_flexif_clk] [get_bd_pins dcmac_0/rx_flexif_clk]
connect_bd_net [get_bd_pins rx_macif_clk] [get_bd_pins dcmac_0/rx_macif_clk]
connect_bd_net [get_bd_pins rx_serdes_clk] [get_bd_pins dcmac_0/rx_serdes_clk]
connect_bd_net [get_bd_pins s_axi_aclk] [get_bd_pins dcmac_0/s_axi_aclk]
connect_bd_net [get_bd_pins s_axi_aresetn] [get_bd_pins gt_quad_base/apb3presetn] [get_bd_pins dcmac_0/s_axi_aresetn]
connect_bd_net [get_bd_pins ts_clk] [get_bd_pins dcmac_0/ts_clk]
connect_bd_net [get_bd_pins tx_alt_serdes_clk] [get_bd_pins dcmac_0/tx_alt_serdes_clk]
connect_bd_net [get_bd_pins tx_axi_clk] [get_bd_pins dcmac_0/tx_axi_clk] [get_bd_pins axis_ila_0/clk]
connect_bd_net -net tx_axis_tdata0_1 [get_bd_pins tx_axis_tdata0] [get_bd_pins dcmac_0/tx_axis_tdata0] [get_bd_pins axis_ila_0/probe2]
connect_bd_net -net tx_axis_tdata1_1 [get_bd_pins tx_axis_tdata1] [get_bd_pins dcmac_0/tx_axis_tdata1] [get_bd_pins axis_ila_0/probe3]
connect_bd_net -net tx_axis_tuser_ena0_1 [get_bd_pins tx_axis_tuser_ena0] [get_bd_pins dcmac_0/tx_axis_tuser_ena0] [get_bd_pins axis_ila_0/probe4]
connect_bd_net -net tx_axis_tuser_ena1_1 [get_bd_pins tx_axis_tuser_ena1] [get_bd_pins dcmac_0/tx_axis_tuser_ena1] [get_bd_pins axis_ila_0/probe5]
connect_bd_net -net tx_axis_tuser_eop0_1 [get_bd_pins tx_axis_tuser_eop0] [get_bd_pins dcmac_0/tx_axis_tuser_eop0] [get_bd_pins axis_ila_0/probe8]
connect_bd_net -net tx_axis_tuser_eop1_1 [get_bd_pins tx_axis_tuser_eop1] [get_bd_pins dcmac_0/tx_axis_tuser_eop1] [get_bd_pins axis_ila_0/probe9]
connect_bd_net -net tx_axis_tuser_err0_1 [get_bd_pins tx_axis_tuser_err0] [get_bd_pins dcmac_0/tx_axis_tuser_err0]
connect_bd_net -net tx_axis_tuser_err1_1 [get_bd_pins tx_axis_tuser_err1] [get_bd_pins dcmac_0/tx_axis_tuser_err1]
connect_bd_net -net tx_axis_tuser_mty0_1 [get_bd_pins tx_axis_tuser_mty0] [get_bd_pins dcmac_0/tx_axis_tuser_mty0] [get_bd_pins axis_ila_0/probe10]
connect_bd_net -net tx_axis_tuser_mty1_1 [get_bd_pins tx_axis_tuser_mty1] [get_bd_pins dcmac_0/tx_axis_tuser_mty1] [get_bd_pins axis_ila_0/probe11]
connect_bd_net -net tx_axis_tuser_sop0_1 [get_bd_pins tx_axis_tuser_sop0] [get_bd_pins dcmac_0/tx_axis_tuser_sop0] [get_bd_pins axis_ila_0/probe6]
connect_bd_net -net tx_axis_tuser_sop1_1 [get_bd_pins tx_axis_tuser_sop1] [get_bd_pins dcmac_0/tx_axis_tuser_sop1] [get_bd_pins axis_ila_0/probe7]
connect_bd_net -net tx_axis_tvalid_0_1 [get_bd_pins tx_axis_tvalid_0] [get_bd_pins dcmac_0/tx_axis_tvalid_0] [get_bd_pins axis_ila_0/probe0]
connect_bd_net [get_bd_pins tx_core_clk] [get_bd_pins dcmac_0/tx_core_clk]
connect_bd_net [get_bd_pins tx_flexif_clk] [get_bd_pins dcmac_0/tx_flexif_clk]
connect_bd_net [get_bd_pins tx_macif_clk] [get_bd_pins dcmac_0/tx_macif_clk]
connect_bd_net [get_bd_pins tx_serdes_clk] [get_bd_pins dcmac_0/tx_serdes_clk]
connect_bd_net [get_bd_pins util_ds_buf_0/IBUFDS_GTME5_O] [get_bd_pins gt_quad_base/GT_REFCLK0]
connect_bd_net [get_bd_pins util_ds_buf_0/IBUFDS_GTME5_ODIV2] [get_bd_pins bufg_gt_odiv2/outclk]
connect_bd_net [get_bd_pins util_ds_buf_mbufg_rx_0/MBUFG_GT_O1] [get_bd_pins ch0_rx_usr_clk_0]
connect_bd_net [get_bd_pins util_ds_buf_mbufg_rx_0/MBUFG_GT_O2] \
  [get_bd_pins ch0_rx_usr_clk2_0] [get_bd_pins gt_quad_base/ch0_rxusrclk] [get_bd_pins gt_quad_base/ch1_rxusrclk] \
  [get_bd_pins gt_quad_base/ch2_rxusrclk] [get_bd_pins gt_quad_base/ch3_rxusrclk]
connect_bd_net [get_bd_pins util_ds_buf_mbufg_tx_0/MBUFG_GT_O1] [get_bd_pins ch0_tx_usr_clk_0]
connect_bd_net [get_bd_pins util_ds_buf_mbufg_tx_0/MBUFG_GT_O2] \
  [get_bd_pins ch0_tx_usr_clk2_0] [get_bd_pins gt_quad_base/ch0_txusrclk] [get_bd_pins gt_quad_base/ch1_txusrclk] \
  [get_bd_pins gt_quad_base/ch2_txusrclk] [get_bd_pins gt_quad_base/ch3_txusrclk]
connect_bd_net [get_bd_pins xlconstant_0/dout] [get_bd_pins util_ds_buf_mbufg_tx_0/MBUFG_GT_CE] [get_bd_pins util_ds_buf_mbufg_rx_0/MBUFG_GT_CE]

current_bd_instance /axi_uart_bridge
connect_bd_intf_net [get_bd_intf_pins M_AXI] [get_bd_intf_pins axi_uart_bridge/M_AXI]
connect_bd_intf_net [get_bd_intf_pins axi_uartlite/S_AXI] [get_bd_intf_pins axi_uart_bridge/M_UART]
connect_bd_intf_net -intf_net axi_uartlite_0_UART [get_bd_intf_pins UART] [get_bd_intf_pins axi_uartlite/UART]
connect_bd_net [get_bd_pins aclk] [get_bd_pins axi_uart_bridge/aclk] [get_bd_pins axi_uartlite/s_axi_aclk]
connect_bd_net [get_bd_pins aresetn] [get_bd_pins axi_uart_bridge/aresetn] [get_bd_pins axi_uartlite/s_axi_aresetn]
connect_bd_net [get_bd_pins axi_uartlite/interrupt] [get_bd_pins axi_uart_bridge/UART_INT]

current_bd_instance /
connect_bd_intf_net [get_bd_intf_ports qsfp0_clk] [get_bd_intf_pins pl_rtl/DCMAC_GT_REFCLK]
connect_bd_intf_net [get_bd_intf_pins axi_uart_bridge/M_AXI] [get_bd_intf_pins pl_rtl/S00_AXI]
connect_bd_intf_net [get_bd_intf_ports UART] [get_bd_intf_pins axi_uart_bridge/UART]
connect_bd_intf_net [get_bd_intf_ports GT_Serial] [get_bd_intf_pins pl_rtl/GT_Serial]
connect_bd_net -net CIPS_0_pl_resetn1 [get_bd_pins versal_cips/pl0_resetn] [get_bd_pins clk_wizard/resetn] [get_bd_pins proc_sys_reset/ext_reset_in]
connect_bd_net -net clk_wizard_0_clk_out1 [get_bd_pins clk_wizard/clk_out1] \
  [get_bd_pins proc_sys_reset/slowest_sync_clk] [get_bd_pins pl_rtl/aclk] [get_bd_pins axi_uart_bridge/aclk]
connect_bd_net -net clk_wizard_0_locked [get_bd_pins clk_wizard/locked] [get_bd_pins proc_sys_reset/dcm_locked]
connect_bd_net -net proc_sys_reset_0_peripheral_aresetn [get_bd_pins proc_sys_reset/peripheral_aresetn] \
  [get_bd_pins pl_rtl/aresetn] [get_bd_pins axi_uart_bridge/aresetn]
connect_bd_net [get_bd_pins qsfpdd2_lpmode/dout] [get_bd_ports QSFPDD2_LPMODE] [get_bd_ports QSFPDD1_LPMODE]
connect_bd_net [get_bd_pins qsfpdd2_resetl/dout] [get_bd_ports QSFPDD2_RESETL] [get_bd_ports QSFPDD1_RESETL]
connect_bd_net -net versal_cips_0_pl0_ref_clk [get_bd_pins versal_cips/pl0_ref_clk] [get_bd_pins clk_wizard/clk_in1]
set_property PFM.CLOCK {clk_out1 {id "0" is_default "true" proc_sys_reset "/proc_sys_reset" status "fixed"}} [get_bd_cells clk_wizard]

# ---- address map ----
assign_bd_address -offset 0x00000000A4000000 -range 1M -target_address_space [get_bd_addr_spaces axi_uart_bridge/axi_uart_bridge/M_AXI] [get_bd_addr_segs pl_rtl/ethernet/dcmac_ip/dcmac_0/s_axi/Reg]
assign_bd_address -offset 0x00000000A4100000 -range 4K -target_address_space [get_bd_addr_spaces axi_uart_bridge/axi_uart_bridge/M_AXI] [get_bd_addr_segs pl_rtl/dcmac_ctrl/S_AXI/reg0]
assign_bd_address -offset 0x00000000A5040000 -range 4K -target_address_space [get_bd_addr_spaces axi_uart_bridge/axi_uart_bridge/M_AXI] [get_bd_addr_segs pl_rtl/packet_config/S_AXI/reg0]
assign_bd_address -offset 0x40600000 -range 64K -target_address_space [get_bd_addr_spaces axi_uart_bridge/axi_uart_bridge/M_UART] [get_bd_addr_segs axi_uart_bridge/axi_uartlite/S_AXI/Reg]

validate_bd_design
save_bd_design
